# EAGLE design USB (EAGLE 9.5.0)
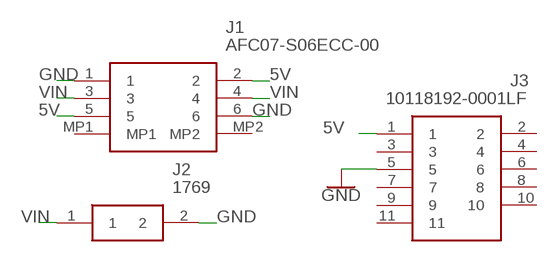
[diagram p0: schematic, sheet 1]

## Parts
J1  AFC07-S06ECC-00  [AFC07S06ECC00]
J2  1769  [1769]
J3  10118192-0001LF  [101181920001LF]

## Nets
5V: J1.2 J1.5 J3.1
GND: J1.1 J1.6 J2.2 J3.5
VIN: J1.3 J1.4 J2.1
Unconnected: J1.MP1 J1.MP2 J3.2 J3.3 J3.4 J3.6 J3.7 J3.8 J3.9 J3.10 J3.11

## Library data of the parts
J1 = SamacSys_Parts:AFC07-S06ECC-00: FFC, FPC Connectors 0.5mm 6P RoHS Source: Datasheet <https://datasheet.lcsc.com/szlcsc/JUSHUO-AFC07-S06ECC-00_C11083.pdf>; DESCRIPTION: FFC, FPC Connectors 0.5mm 6P RoHS; HEIGHT: 2.05mm; MANUFACTURER_NAME: JUSHUO; MANUFACTURER_PART_NUMBER: AFC07-S06ECC-00
J2 = SamacSys_Parts:1769: Adafruit Accessories JST-PH 2-pin SMT Right Angle Connect Source: Datasheet <https://cdn-shop.adafruit.com/datasheets/17311.pdf>; ALLIED_NUMBER: 70927965; ALLIED_PRICE-STOCK: https://www.alliedelec.com/adafruit-industries-1769/70927965/; DESCRIPTION: Adafruit Accessories JST-PH 2-pin SMT Right Angle Connect; HEIGHT: mm; MANUFACTURER_NAME: Adafruit; MANUFACTURER_PART_NUMBER: 1769; MOUSER_PART_NUMBER: 485-1769; MOUSER_PRICE-STOCK: https://www.mouser.com/Search/Refine.aspx?Keyword=485-1769
J3 = SamacSys_Parts:10118192-0001LF: USB Connectors 5P MICRO USB TYPE B RECEPTACLE Source: Datasheet <https://www.mouser.tw/datasheet/2/18/10118192-1361887.pdf>; ALLIED_NUMBER: 70236826; ALLIED_PRICE-STOCK: https://www.alliedelec.com/amphenolfci-10118192-0001lf/70236826/; DESCRIPTION: USB Connectors 5P MICRO USB TYPE B RECEPTACLE; HEIGHT: 2.8mm; MANUFACTURER_NAME: FCI / Amphenol; MANUFACTURER_PART_NUMBER: 10118192-0001LF; MOUSER_PART_NUMBER: 649-10118192-0001LF

## Board
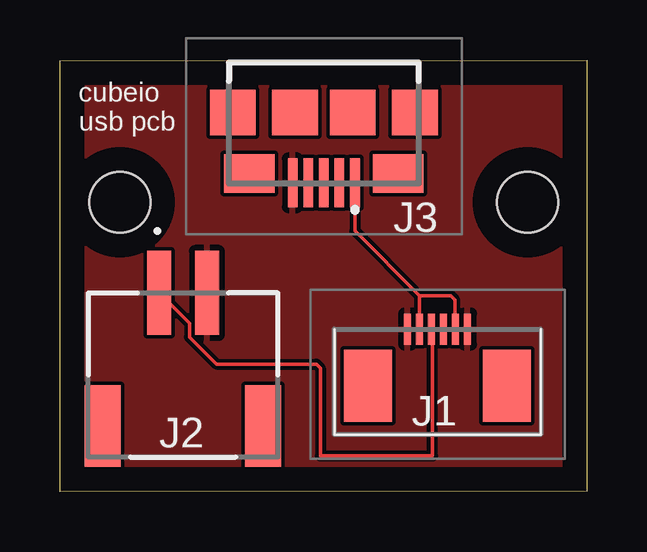
[diagram p1: board, top side]

Size 21.98 x 17.98 mm. Coordinates in mm from the lower left corner, seen from the top.
Outline: 0,0 0,17.96 21.98,17.98 21.98,0.02 0,0
Copper layers (1*16): Top 0.035mm / dielectric 1.5mm / Bottom 0.035mm
Design rules "default": minimum track width 6mil, minimum drill 0.35mm, track to track 6mil, track to pad 6mil, pad to pad 6mil, via to via 6mil, smd to smd 6mil, copper to edge 40mil, drill to drill 6mil, minimum pad ring 10mil, minimum via ring 8mil, stop-mask expansion 4mil, vias tented up to drill 0mil, thermal gap 10mil
Holes 2.54 mm at 19.5,12.06 2.5,12.06

### Footprints (pad centres in the part's own frame; a part is rotated, then mirrored left to right if it is on the bottom)
AFC07S06ECC00 = smd 0.3 x 1.3: 1 -1.25,2.2; 2 -0.75,2.2; 3 -0.25,2.2; 4 0.25,2.2; 5 0.75,2.2; 6 1.25,2.2 | smd 2 x 3: MP1 -2.9,-0.15; MP2 2.9,-0.15
1769 = smd 1 x 3.5: 1 -1,0; 2 1,0 | smd 1.5 x 3.4: 3 -3.35,-5.55; 4 3.35,-5.55
101181920001LF = smd 0.4 x 2.032: 1 -1.3,1.936; 2 -0.65,1.936; 3 0,1.936; 4 0.65,1.936; 5 1.3,1.936 | smd 2.1 x 1.6: 6 -3.1,1.557; 7 3.1,1.557 | smd 1.9 x 1.9: 8 -1.2,-0.993; 9 1.2,-0.993; 10 -3.8,-0.993; 11 3.8,-0.993

### Placement (x,y rotation side)
J1  15.75,4.57 0 top
J2  5.13,8.28 0 top
J3  11,14.81 180 top

### Tracks (layer width: path | path; a pad name or v marks a point on that pad's centre or on a via)
5V
  Top 0.152: J3.1 12.3,10.86 14.99,8.17 | 14.99,8.17 J1.2 | J1.5 16.47,6.8 16.47,7.99 16.29,8.17 14.99,8.17
GND
  pour Top: 0.13,0.03 0.13,17.93 21.92,17.92 21.92,0.59 21.43,0.1 0.17,0.1
VIN
  Top 0.152: J1.4 J1.3 15.54,6.73 15.54,1.49 10.86,1.49 10.86,5.15 10.7,5.31 6.53,5.31 5.4,6.44 5.4,7.01 J2.1

### Text on the board
tNames: cubeio / usb pcb | J3
bNames: Perkins&Will / Cubeio USB / December 2019 / v3